# EasyEDA Pro project Smart Coaster_rev1.epro, schematic Smart Coaster

## Sheets
1 HMI: Board Name: Smart Coaster; Create Date: 2025-01-15; Page Name: HMI; Project Name: Smart Coaster; Schematic Name: Smart Coaster; Update Date: 2025-01-17; Company: Paul Hampson; Page Size: A4; Version: V1.0
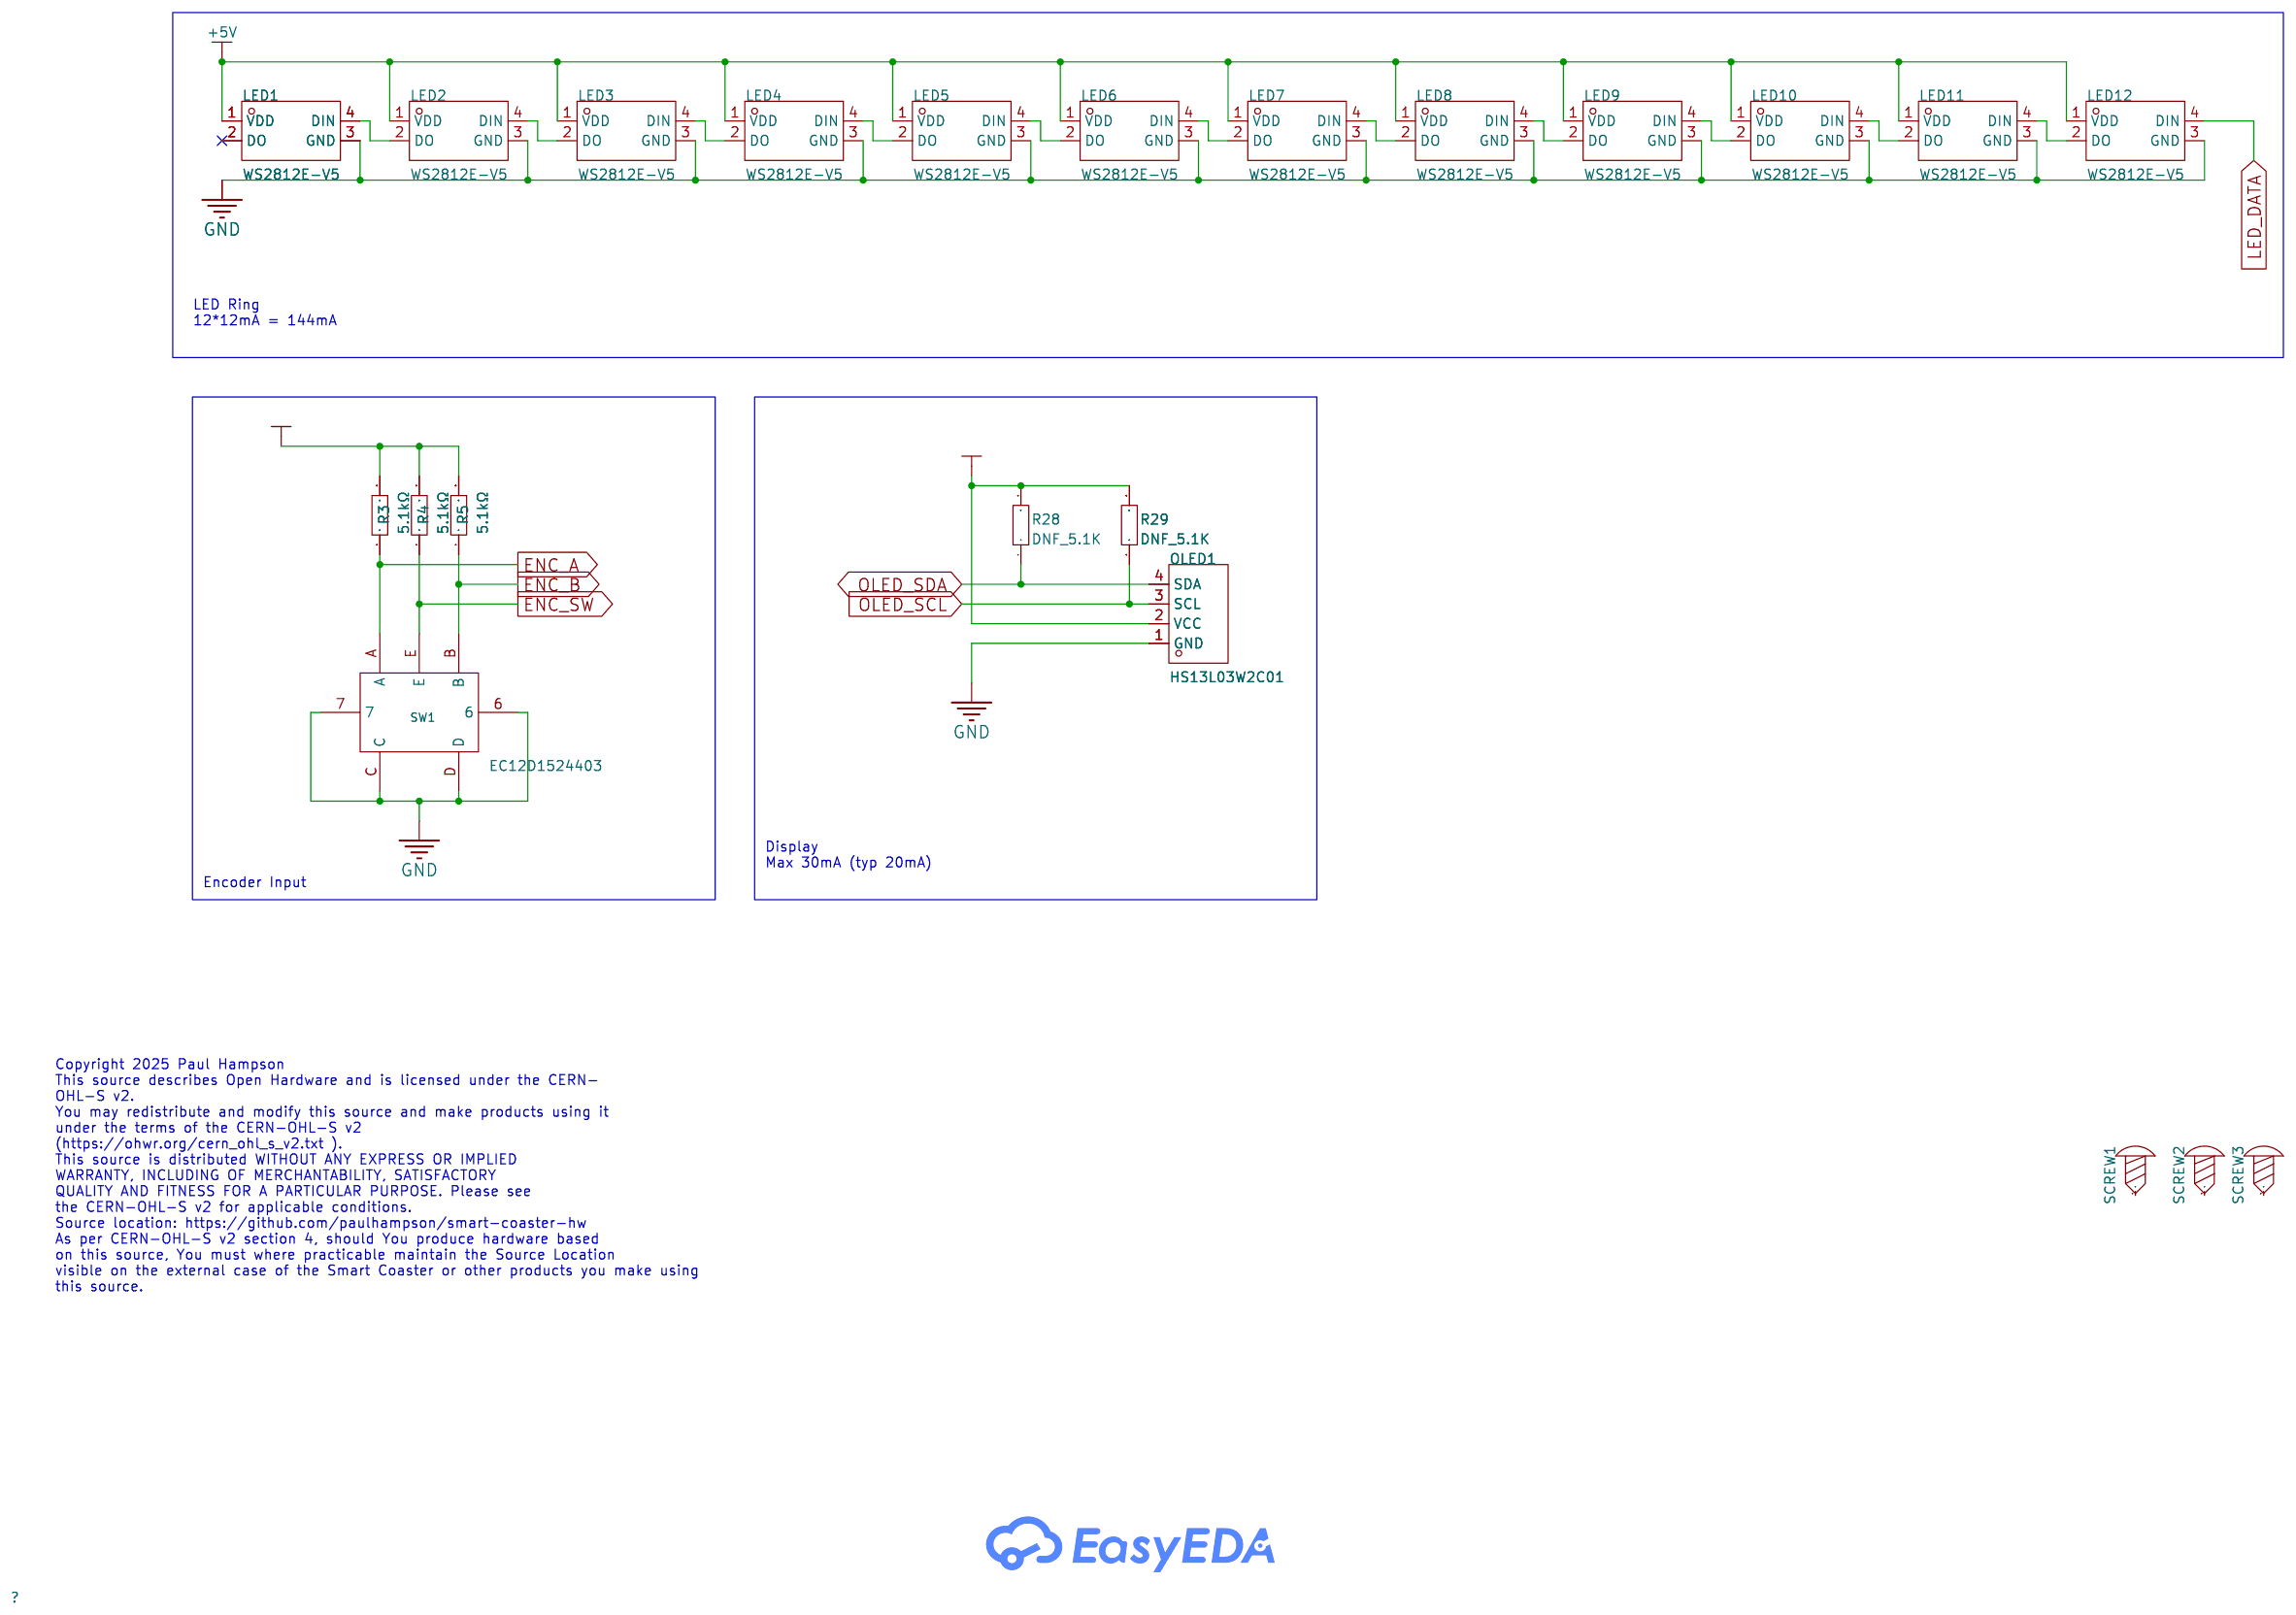
[diagram p0: HMI]
2 Processor: Page Name: Processor
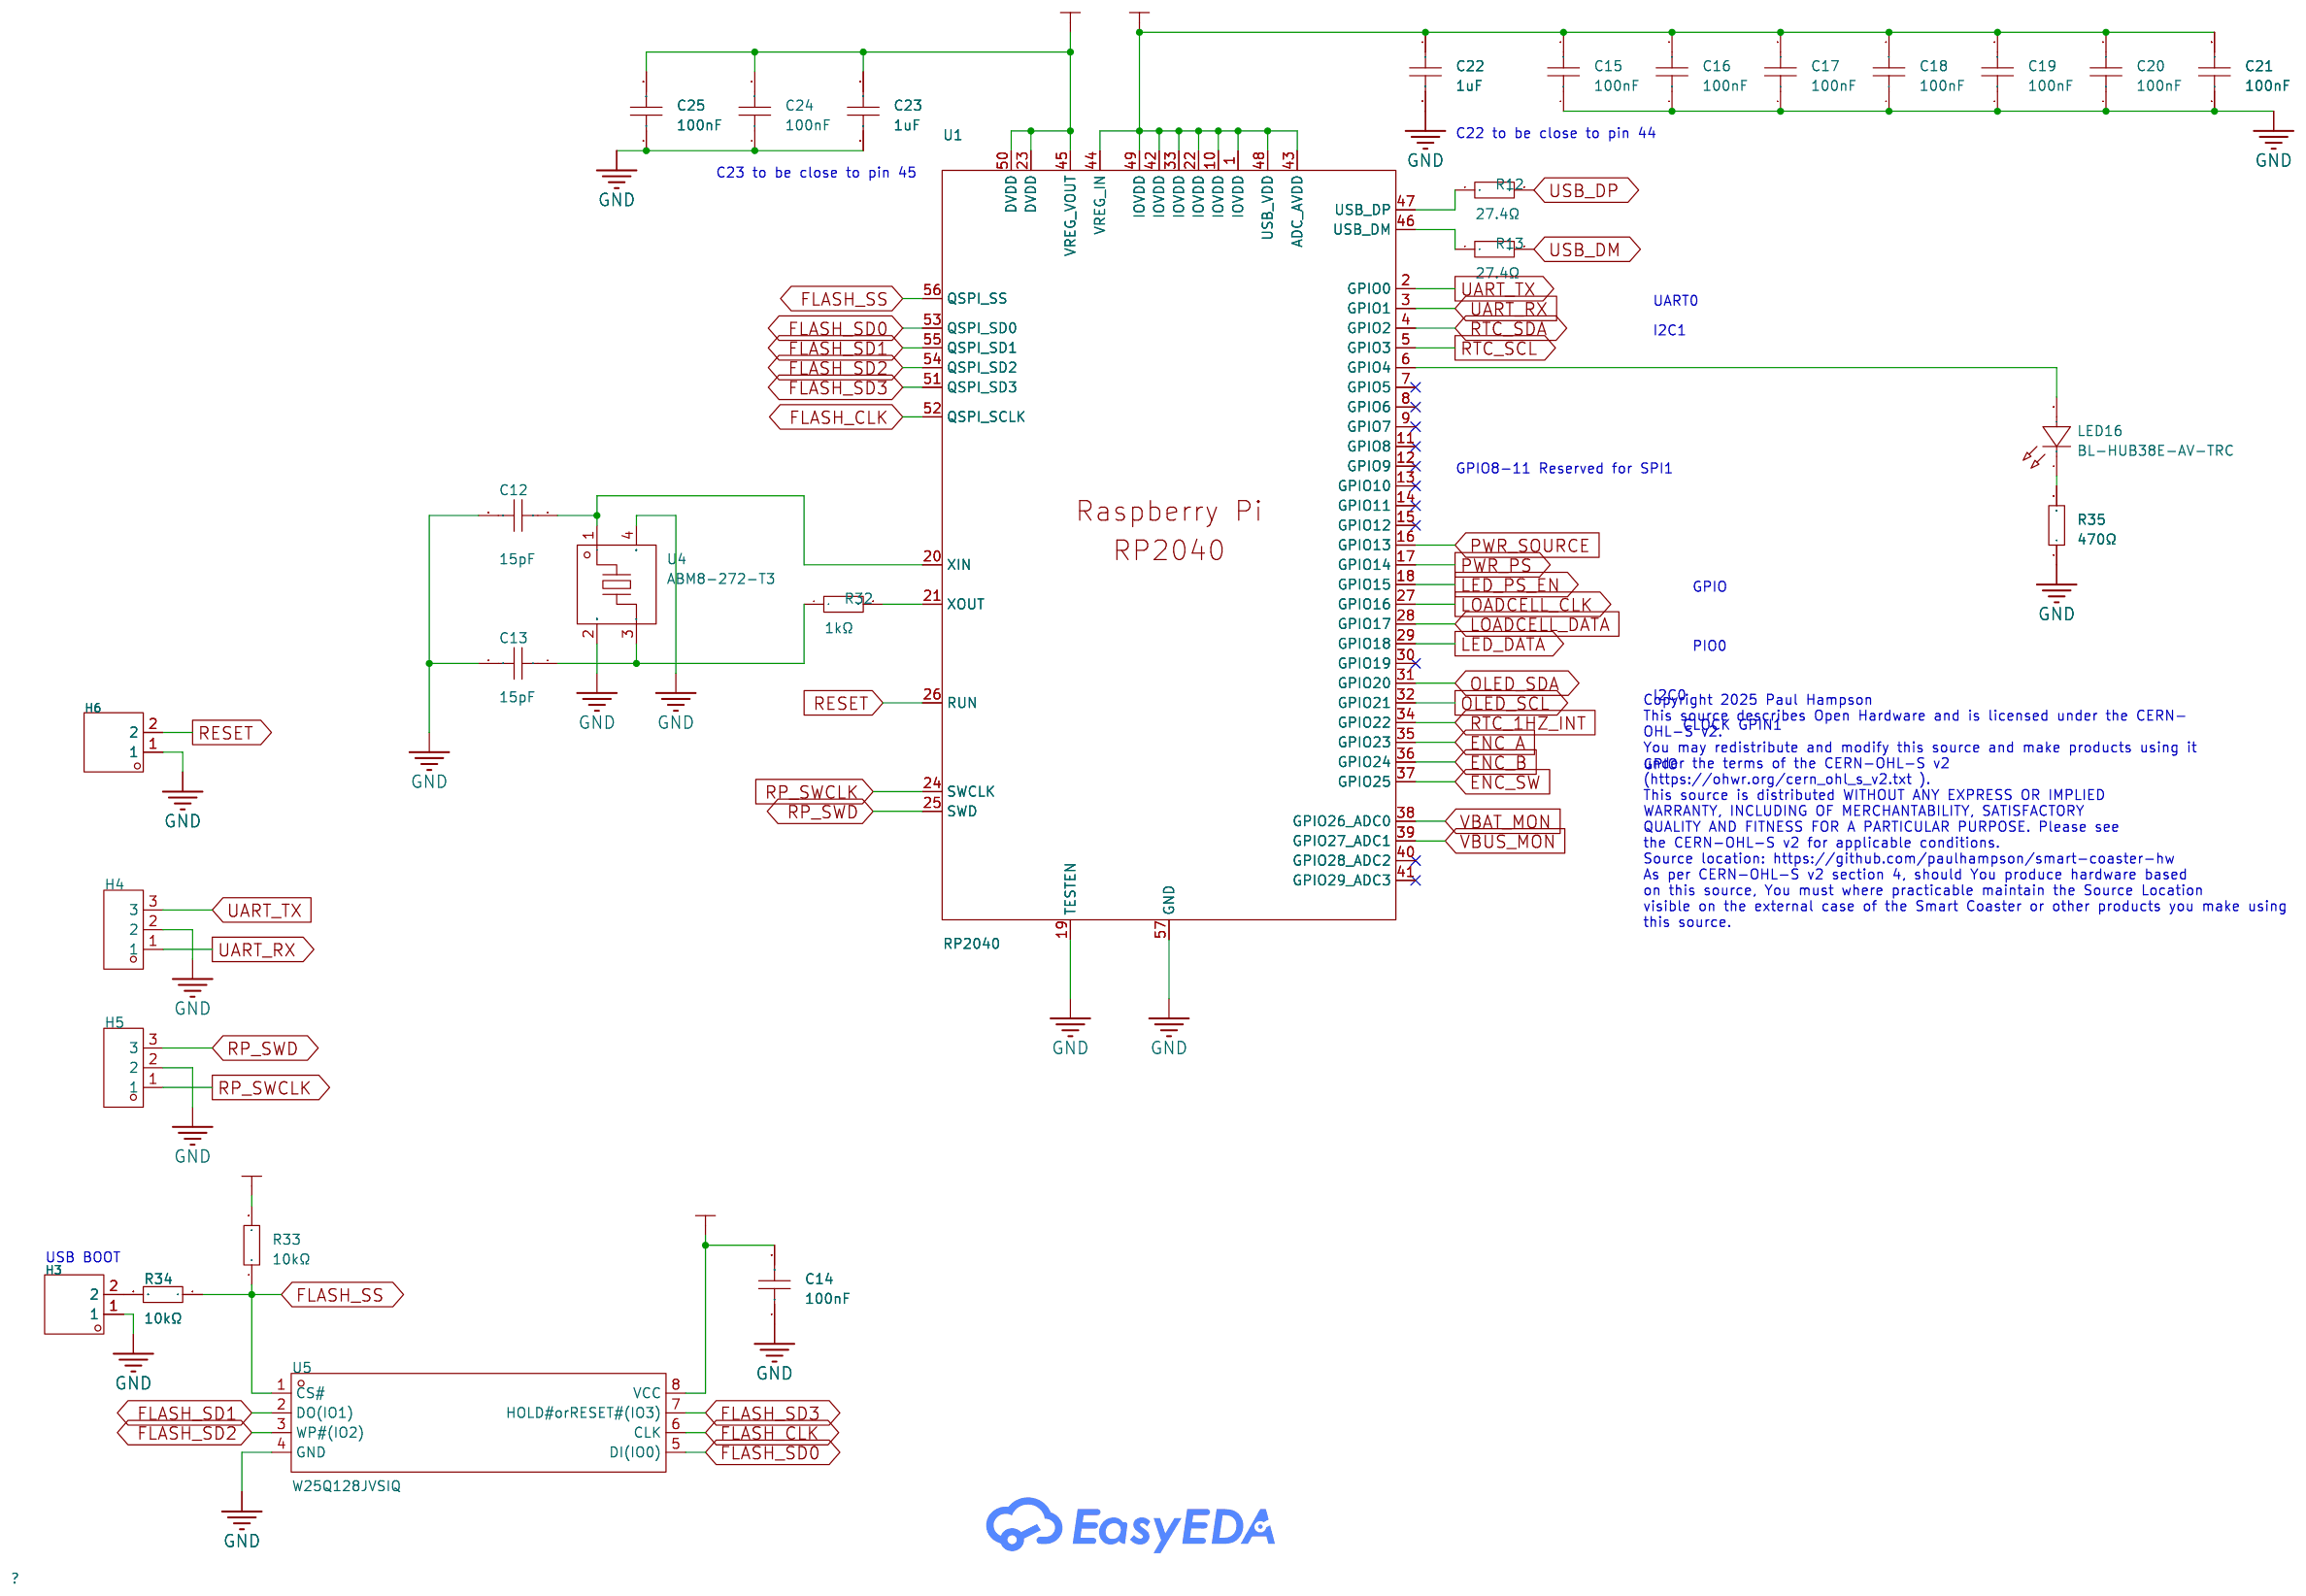
[diagram p1: Processor]
3 Power: Page Name: Power; Update Date: 2025-01-16
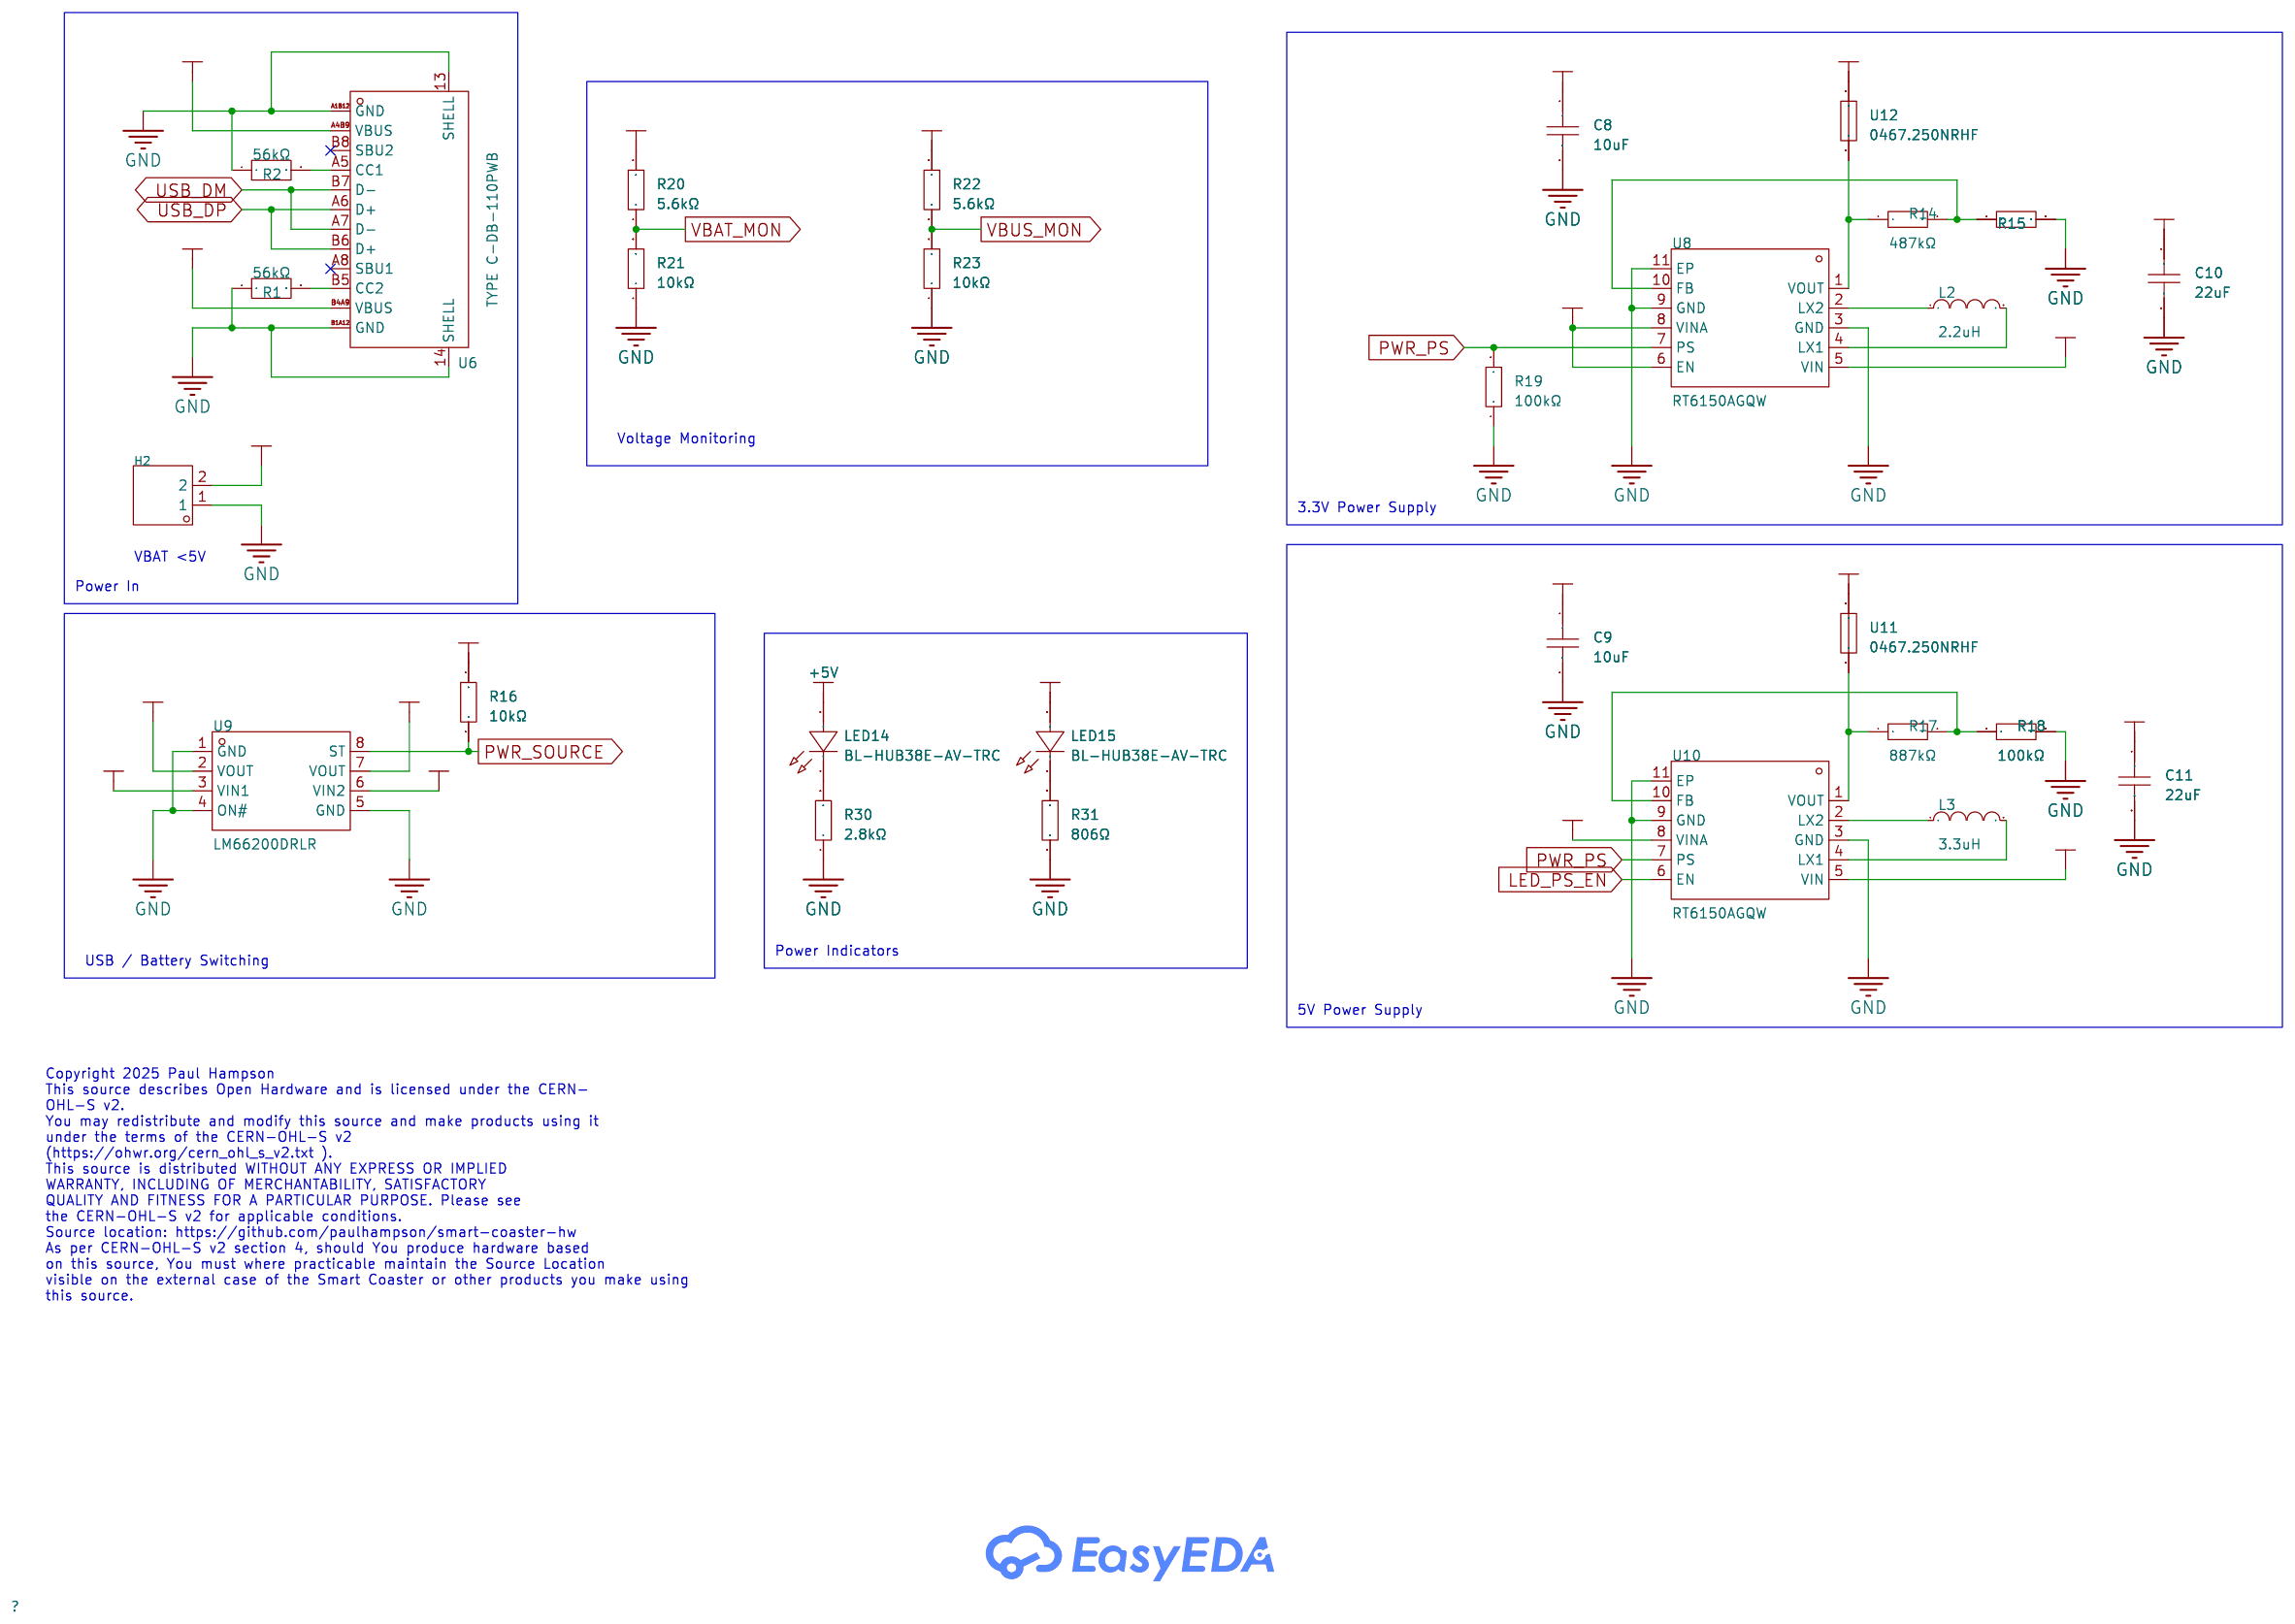
[diagram p2: Power]
4 Load Cell: Page Name: Load Cell; Update Date: 2025-01-16
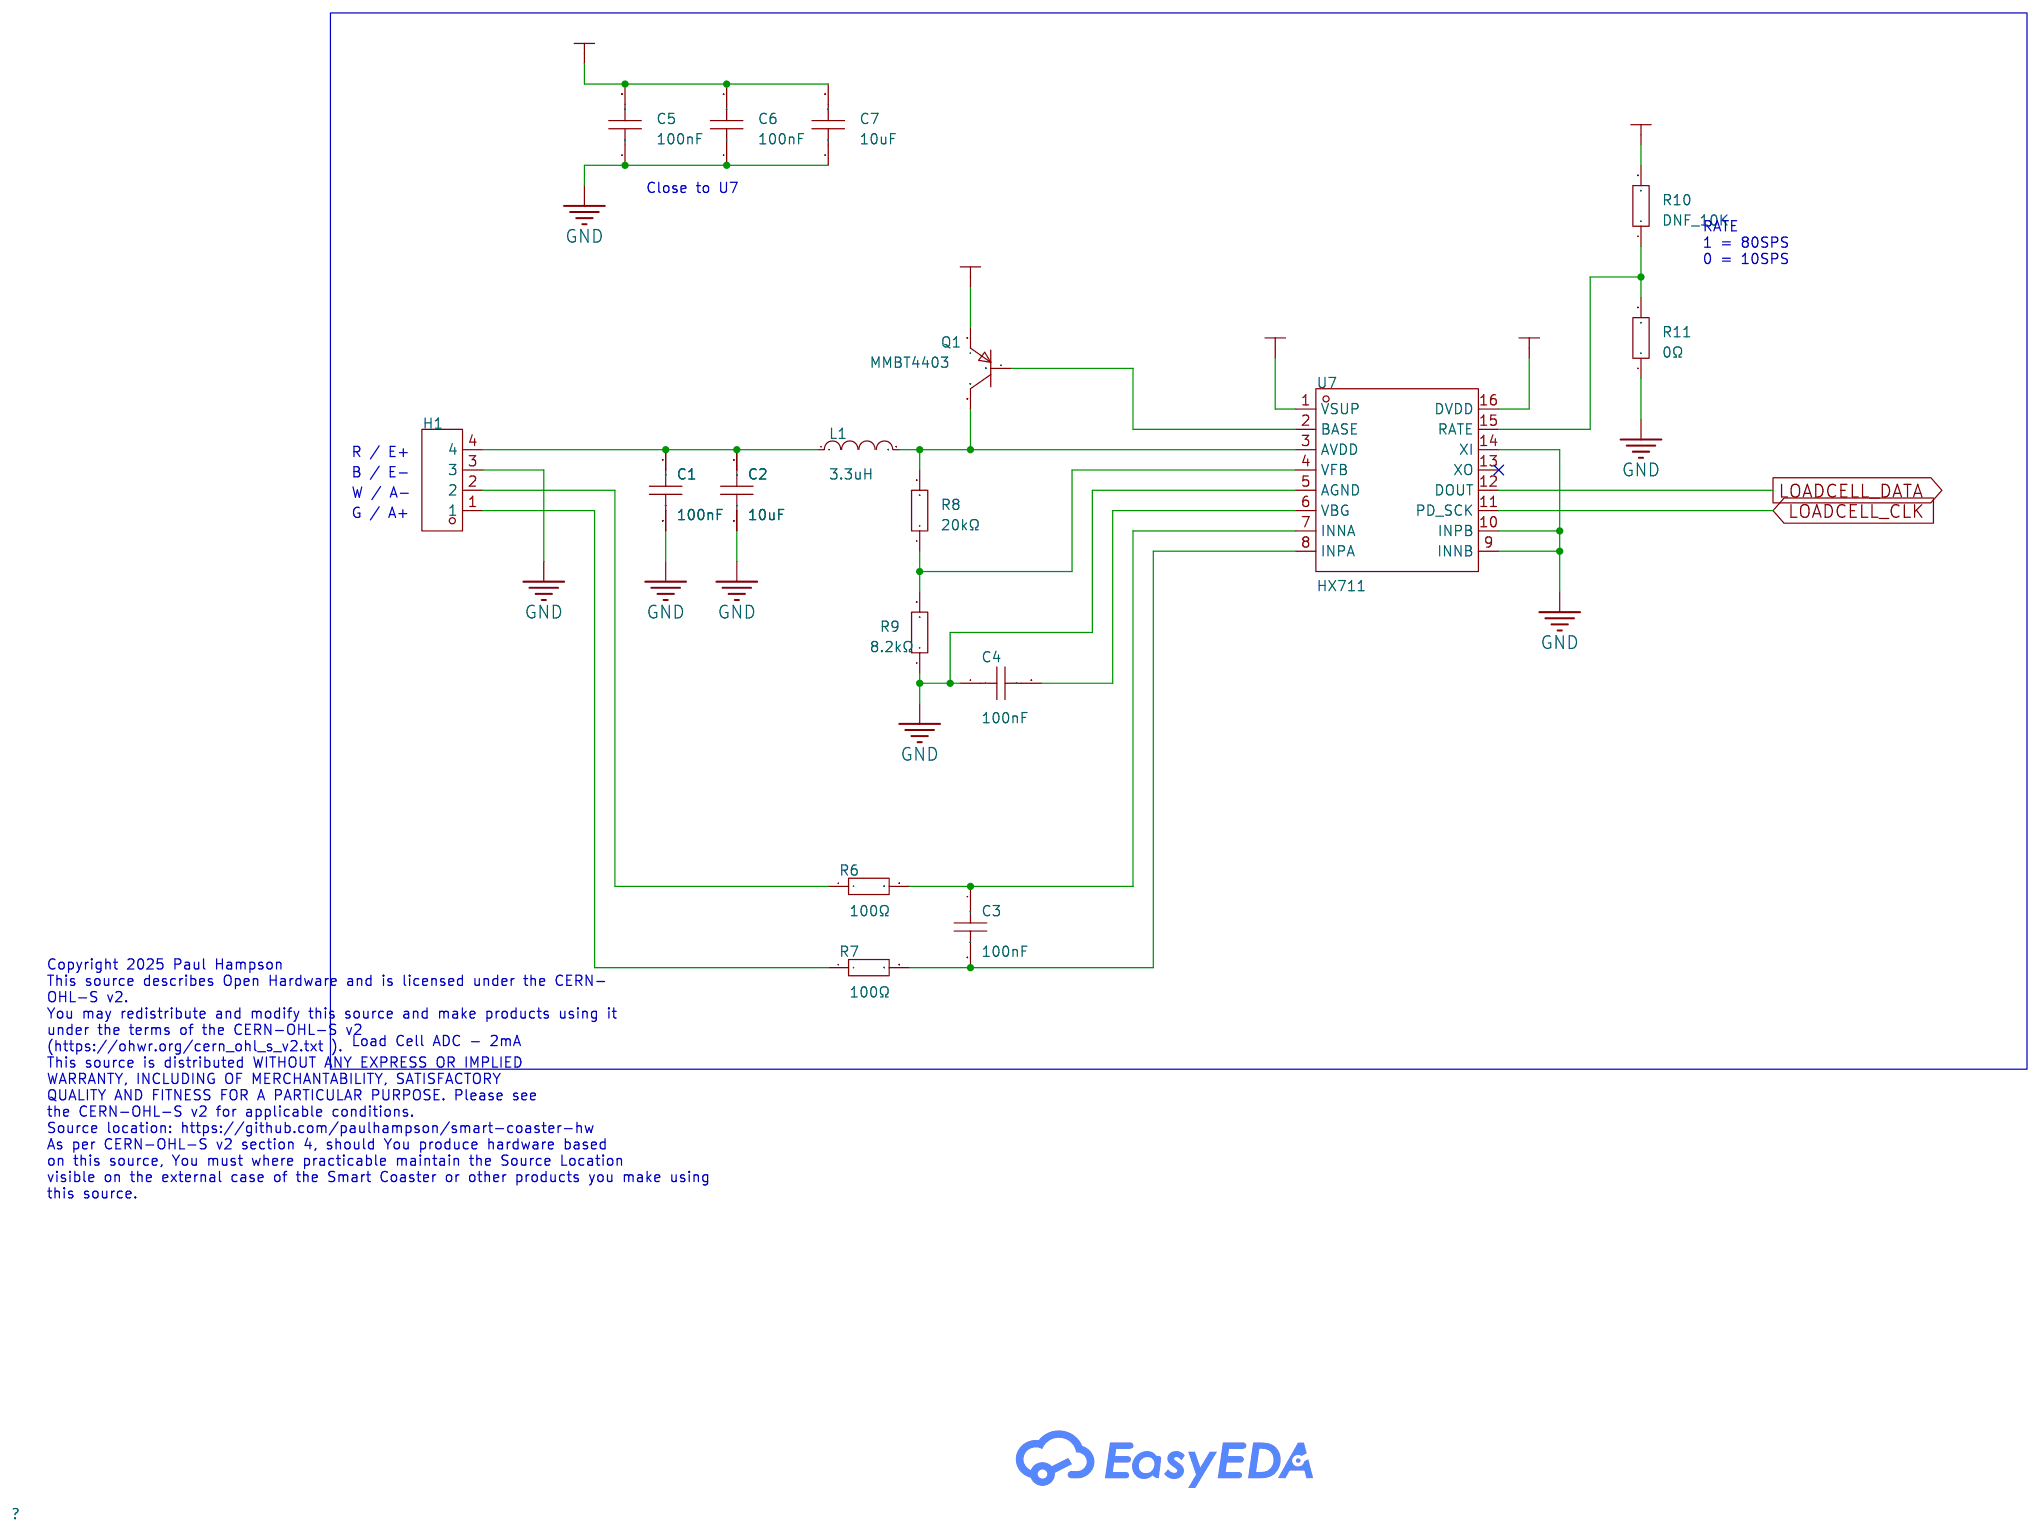
[diagram p3: Load Cell]
5 RTC: Create Date: 2025-01-16; Page Name: RTC
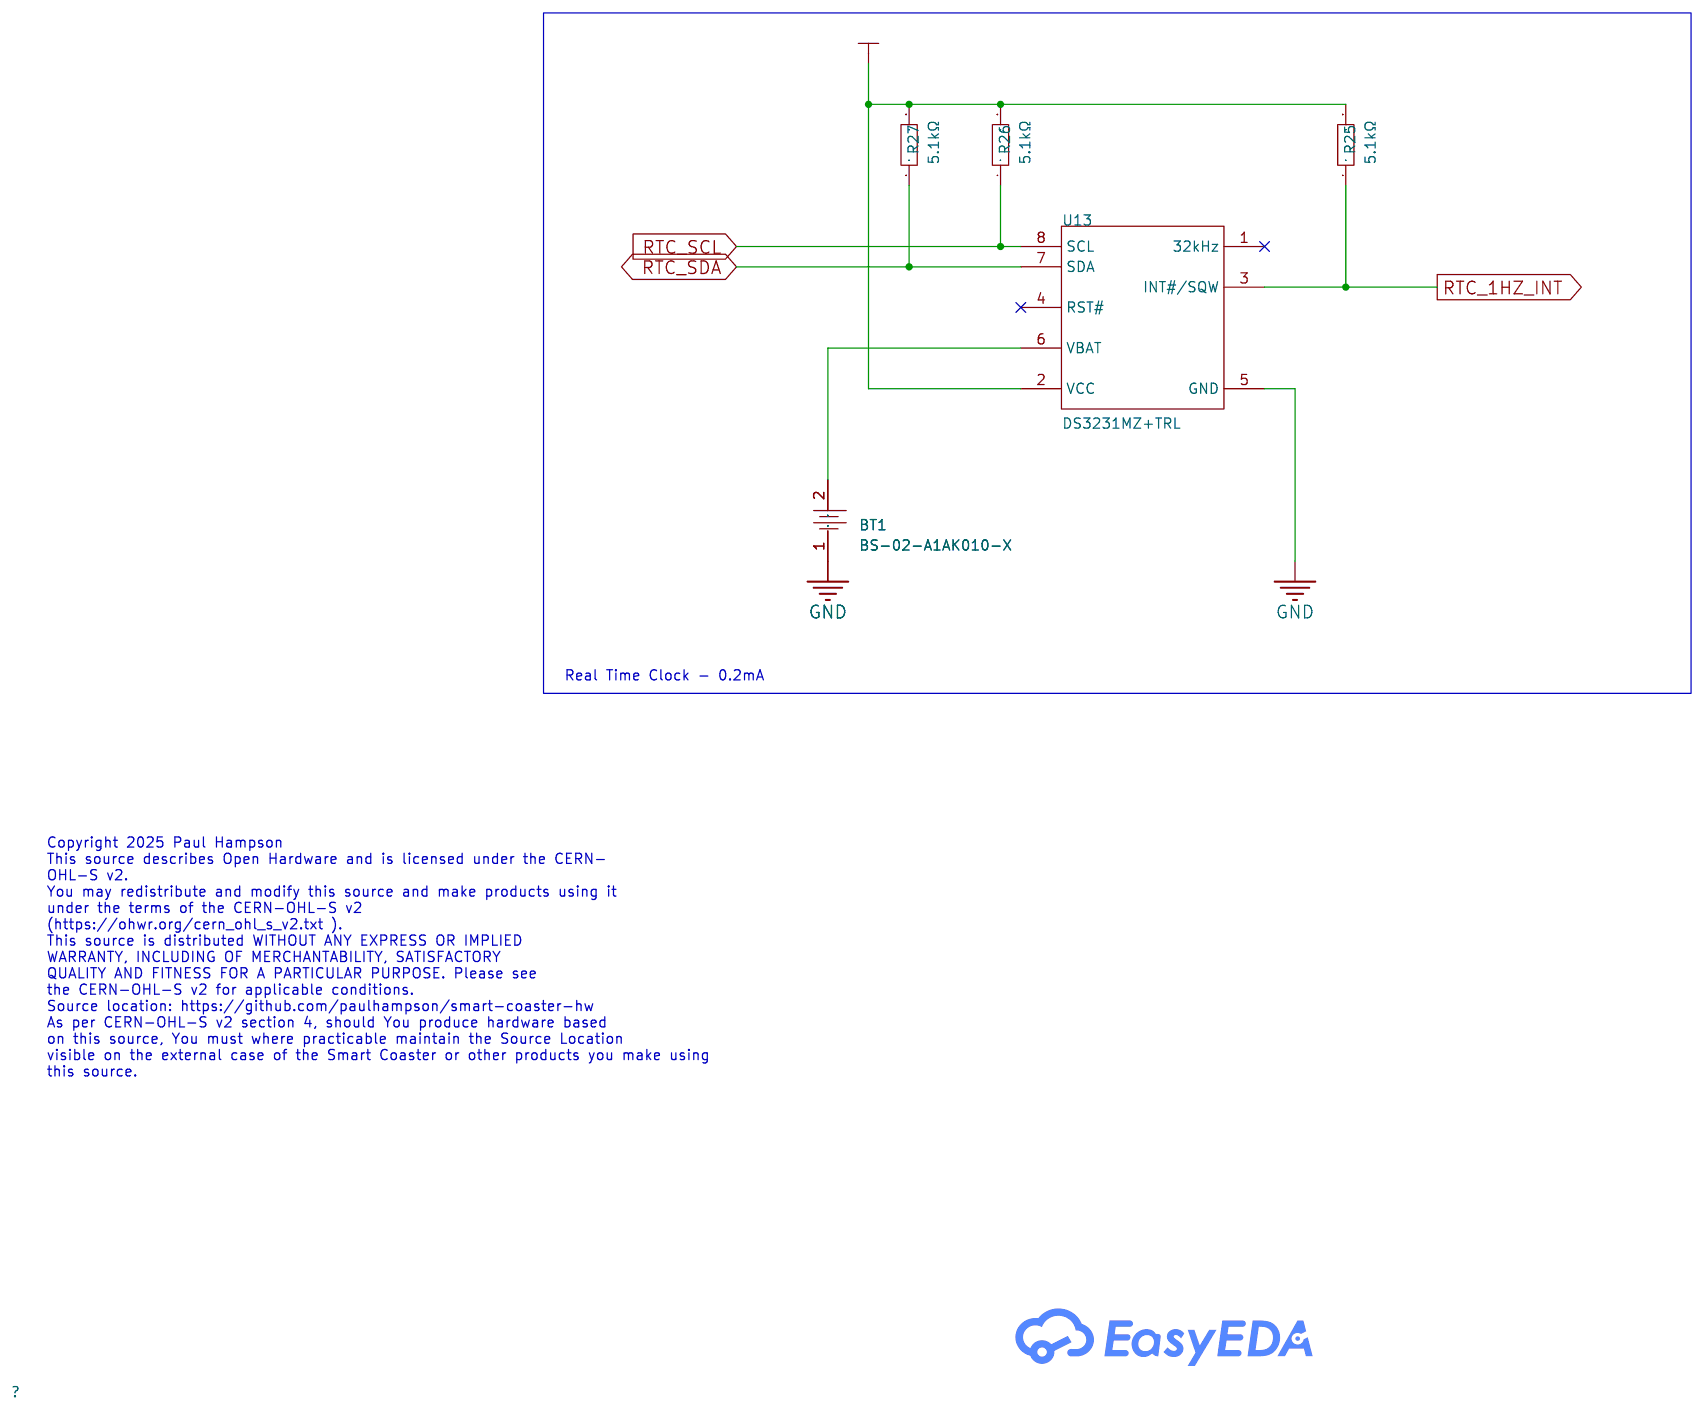
[diagram p4: RTC]

## Parts
sheet HMI
LED1  WS2812E-V5  [LED-SMD_4P-L5.0-W5.0-LS5.4-TL-1]
LED2  WS2812E-V5  [LED-SMD_4P-L5.0-W5.0-LS5.4-TL-1]
LED3  WS2812E-V5  [LED-SMD_4P-L5.0-W5.0-LS5.4-TL-1]
LED4  WS2812E-V5  [LED-SMD_4P-L5.0-W5.0-LS5.4-TL-1]
LED5  WS2812E-V5  [LED-SMD_4P-L5.0-W5.0-LS5.4-TL-1]
LED6  WS2812E-V5  [LED-SMD_4P-L5.0-W5.0-LS5.4-TL-1]
LED7  WS2812E-V5  [LED-SMD_4P-L5.0-W5.0-LS5.4-TL-1]
LED8  WS2812E-V5  [LED-SMD_4P-L5.0-W5.0-LS5.4-TL-1]
LED9  WS2812E-V5  [LED-SMD_4P-L5.0-W5.0-LS5.4-TL-1]
LED10  WS2812E-V5  [LED-SMD_4P-L5.0-W5.0-LS5.4-TL-1]
LED11  WS2812E-V5  [LED-SMD_4P-L5.0-W5.0-LS5.4-TL-1]
LED12  WS2812E-V5  [LED-SMD_4P-L5.0-W5.0-LS5.4-TL-1]
OLED1  HS13L03W2C01  [OLED-TH_L35.4-W33.5_HS13L03W2C01]
R3  5.1kΩ  [R0603]
R4  5.1kΩ  [R0603]
R5  5.1kΩ  [R0603]
R28  DNF_5.1K  [R0603]
R29  DNF_5.1K  [R0603]
SCREW1  -  [Screw-Hole-M3]
SCREW2  -  [Screw-Hole-M3]
SCREW3  -  [Screw-Hole-M3]
SW1  EC12D1524403  [SW-TH_EC12D1524403]
sheet Load Cell
C1  100nF  [C0603]
C2  10uF  [C0603]
C3  100nF  [C0603]
C4  100nF  [C0603]
C5  100nF  [C0603]
C6  100nF  [C0603]
C7  10uF  [C0603]
H1  -  [HDR-TH_4P-P2.54-V-M]
L1  3.3uH  [L0603]
Q1  MMBT4403  [SOT-23-3_L2.9-W1.3-P1.90-LS2.4-BR]
R6  100Ω  [R0603]
R7  100Ω  [R0603]
R8  20kΩ  [R0603]
R9  8.2kΩ  [R0603]
R10  DNF_10K  [R0603]
R11  0Ω  [R0402]
U7  HX711  [SOP-16_L10.0-W3.9-P1.27-LS6.0-BL]
sheet Power
C8  10uF  [C0603]
C9  10uF  [C0603]
C10  22uF  [C0805]
C11  22uF  [C0805]
H2  -  [HDR-TH_2P-P2.54-V-M-1]
L2  2.2uH  [L0805]
L3  3.3uH  [L0805]
LED14  BL-HUB38E-AV-TRC  [LED-SMD_L1.7-W1.1-RD_RED-SIDE]
LED15  BL-HUB38E-AV-TRC  [LED-SMD_L1.7-W1.1-RD_RED-SIDE]
R1  56kΩ  [R0603]
R2  56kΩ  [R0603]
R14  487kΩ  [R0603]
R15  86.6kΩ  [R0603]
R16  10kΩ  [R0603]
R17  887kΩ  [R0603]
R18  100kΩ  [R0603]
R19  100kΩ  [R0603]
R20  5.6kΩ  [R0805]
R21  10kΩ  [R0603]
R22  5.6kΩ  [R0805]
R23  10kΩ  [R0603]
R30  2.8kΩ  [R0402]
R31  806Ω  [R0402]
U6  TYPE C-DB-110PWB  [USB-C-SMD_TYPE-C-DB-111PWB]
U8  RT6150AGQW  [WDFN-10_L3.0-W3.0-P0.50-BL-EP]
U9  LM66200DRLR  [SOT-583-8_L2.1-W1.2-P0.50-LS1.6-BL]
U10  RT6150AGQW  [WDFN-10_L3.0-W3.0-P0.50-BL-EP]
U11  0467.250NRHF  [F0603]
U12  0467.250NRHF  [F0603]
sheet Processor
C12  15pF  [C0402]
C13  15pF  [C0402]
C14  100nF  [C0402]
C15  100nF  [C0402]
C16  100nF  [C0402]
C17  100nF  [C0402]
C18  100nF  [C0402]
C19  100nF  [C0402]
C20  100nF  [C0402]
C21  100nF  [C0402]
C22  1uF  [C0402]
C23  1uF  [C0402]
C24  100nF  [C0402]
C25  100nF  [C0402]
H3  -  [HDR-TH_2P-P2.54-V-M-1]
H4  -  [HDR-TH_3P-P2.54-V-M]
H5  -  [HDR-TH_3P-P2.54-V-M]
H6  -  [HDR-TH_2P-P2.54-V-M-1]
LED16  BL-HUB38E-AV-TRC  [LED-SMD_L1.7-W1.1-RD_RED-SIDE]
R12  27.4Ω  [R0402]
R13  27.4Ω  [R0402]
R32  1kΩ  [R0402]
R33  10kΩ  [R0402]
R34  10kΩ  [R0402]
R35  470Ω  [R0402]
U1  RP2040  [LQFN-56_L7.0-W7.0-P0.4-EP]
U4  ABM8-272-T3  [CRYSTAL-SMD_4P-L3.2-W2.5-BL]
U5  W25Q128JVSIQ  [SOIC-8_L5.3-W5.3-P1.27-LS8.0-BL]
sheet RTC
BT1  BS-02-A1AK010-X  [BAT-TH_BS-02-A1AJ010]
R25  5.1kΩ  [R0603]
R26  5.1kΩ  [R0603]
R27  5.1kΩ  [R0603]
U13  DS3231MZ+TRL  [SOIC-8_L4.9-W3.9-P1.27-LS6.0-BL]

## Library data of the parts
LED1-LED12 = WS2812E-V5: LCSC Part Name: RGB三色; Supplier Part: C2920042; Manufacturer: worldsemi; Supplier Footprint: SMD5050; JLCPCB Part Class: Extended Part; Datasheet: https://atta.szlcsc.com/upload/public/pdf/source/20211117/0464A411C41E6FA3BF6C3A8020ED01CE.pdf; Supplier: LCSC; Check: true
OLED1 = HS13L03W2C01: Main Control Chip:SH1106 Interface Type:I2C Size:1.3 Operating Temperature:-40℃~+70℃ Operating Temperature:-40℃~+70℃; LCSC Part Name: 1.3'1.3寸 128*64 OLED显示屏 I2C通讯 SH1106 白光; Supplier Part: C7465997; Manufacturer: HS(汉昇); JLCPCB Part Class: Extended Part; Datasheet: https://atta.szlcsc.com/upload/public/pdf/source/20230720/8731A47396DED074CDCD72E9ACEFB46F.pdf; Supplier: LCSC; Main Control Chip: SH1106; Interface Type: I2C; Size: 1.3; Operating Temperature: -40℃~+70℃; Check: true
R3-R5 R25-R27 = 0603WAF5101T5E: Type:Thick Film Resistors Resistance:5.1kΩ Tolerance:±1% Tolerance:±1% Power(Watts): Overload Voltage (Max): Temperature Coefficient:±100ppm/℃ Temperature Coefficient:±100ppm/℃ Operating Temperature Range:-55℃~+155℃ Operating Temperature Range:-55℃~+155℃; LCSC Part Name: 5.1kΩ ±1% 100mW 厚膜电阻; Supplier Part: C23186; Manufacturer: UNI-ROYAL(厚声); Supplier Footprint: 0603; JLCPCB Part Class: Basic Part; Datasheet: https://atta.szlcsc.com/upload/public/pdf/source/20200306/C422600_1E6D84923E4A46A82E41ADD87F860B5C.pdf; Supplier: LCSC; Type: Thick Film Resistors; Tolerance: ±1%; Temperature Coefficient: ±100ppm/℃; Operating Temperature Range: -55℃~+155℃
R10 R28 R29 = Res_0603: Supplier Footprint: 0603; Check: false
SCREW1-SCREW3 = Screw-Hole-M3: Supplier Footprint: 插件
SW1 = EC12D1524403: Supplier Part: C112349; Manufacturer: ALPSALPINE(阿尔卑斯阿尔派); Supplier Footprint: 插件; JLCPCB Part Class: Extended Part; Datasheet: https://atta.szlcsc.com/upload/public/pdf/source/20170523/1495533935047.pdf; Supplier: LCSC; Check: true
C1 C3-C6 = CGA0603X7R104K500JT: Capacitance:100nF Tolerance:±10% Tolerance:±10% Voltage Rated:50V Temperature Coefficient:; LCSC Part Name: 100nF ±10% 50V; Supplier Part: C6119867; Manufacturer: HRE(芯声); Supplier Footprint: 0603; JLCPCB Part Class: Extended Part; Supplier: LCSC; Tolerance: ±10%; Voltage Rated: 50V; Check: true
C2 C7-C9 = CL10A106MQ8NNNC: Capacitance: Tolerance:±20% Tolerance:±20% Voltage Rated: Temperature Coefficient:; LCSC Part Name: 10uF ±20% 6.3V; Supplier Part: C1691; Manufacturer: SAMSUNG(三星); Supplier Footprint: 0603; JLCPCB Part Class: Extended Part; Datasheet: https://atta.szlcsc.com/upload/public/pdf/source/20160218/1457707763339.pdf; Supplier: LCSC; Tolerance: ±20%
H1 = HDR-M_2.54_1x4P: Supplier Footprint: Through; Check: false
L1 = SCL1608Q3R3KSP: Inductance: Tolerance:±10% Tolerance:±10% Rated Current: Saturation Current (Isat):- DC Resistance (DCR): Q @ Freq:- Frequency - Self Resonant:- Ratings:; LCSC Part Name: 3.3uH ±10%; Supplier Part: C411948; Manufacturer: Sunltech(韩国顺磁); Supplier Footprint: 0603; JLCPCB Part Class: Extended Part; Datasheet: https://atta.szlcsc.com/upload/public/pdf/source/20200731/C411944_7C8237E998DB3EB3F4322F140BC617BA.pdf; Supplier: LCSC; Tolerance: ±10%
Q1 = MMBT4403_C699234: Transistor Type: Collector Current (Ic):600mA Collector-Emitter Breakdown Voltage (Vceo): Power Dissipation (Pd):300mW DC Current Gain (hFE@Ic,Vce):100@150mA,2V DC Current Gain (hFE@Ic,Vce):100@150mA,2V Transition Frequency (fT):200MHz Collector Cut-Off C; Supplier Part: C699234; Manufacturer: YANGJIE(扬杰); Supplier Footprint: SOT-23(TO-236); JLCPCB Part Class: Extended Part; Datasheet: https://atta.szlcsc.com/upload/public/pdf/source/20200709/C699234_CEBC5487FB916D5CBDF220B2A01038BE.pdf; Supplier: LCSC; Collector Current (Ic): 600mA; Power Dissipation (Pd): 300mW; DC Current Gain (hFE@Ic,Vce): 100@150mA,2V; Transition Frequency (fT): 200MHz; Collector Cut-Off Current (Icbo): 100nA; Collector-Emitter Saturation Voltage (VCE(sat)@Ic,Ib): 400mV@150mA,15mA; Operating Temperature: -55℃~+150℃; Check: true
R6 R7 = RTT03101JTP: Type:Thick Film Resistors Resistance: Tolerance:±5% Tolerance:±5% Power(Watts): Overload Voltage (Max): Temperature Coefficient:±100ppm/℃ Temperature Coefficient:±100ppm/℃ Operating Temperature Range:-55℃~+155℃ Operating Temperature Range:-55℃~+155℃; LCSC Part Name: 厚膜电阻 100Ω ±5% 100mW; Supplier Part: C103204; Manufacturer: RALEC(旺诠); Supplier Footprint: 0603; JLCPCB Part Class: Extended Part; Datasheet: https://atta.szlcsc.com/upload/public/pdf/source/20191219/C158410_884373A5B7E1BC76BF57BC45A946C093.pdf; Supplier: LCSC; Type: Thick Film Resistors; Tolerance: ±5%; Temperature Coefficient: ±100ppm/℃; Operating Temperature Range: -55℃~+155℃
R8 = 0603WAJ0203T5E: Type:Thick Film Resistors Resistance:20kΩ Tolerance:±5% Tolerance:±5% Power(Watts): Overload Voltage (Max): Temperature Coefficient:±100ppm/℃ Temperature Coefficient:±100ppm/℃ Operating Temperature Range:-55℃~+155℃ Operating Temperature Range:-55℃~+155℃; LCSC Part Name: 20kΩ ±5% 100mW 厚膜电阻; Supplier Part: C25586; Manufacturer: UNI-ROYAL(厚声); Supplier Footprint: 0603; JLCPCB Part Class: Extended Part; Datasheet: https://atta.szlcsc.com/upload/public/pdf/source/20200306/C422600_1E6D84923E4A46A82E41ADD87F860B5C.pdf; Supplier: LCSC; Type: Thick Film Resistors; Tolerance: ±5%; Temperature Coefficient: ±100ppm/℃; Operating Temperature Range: -55℃~+155℃
R9 = 0603WAJ0822T5E: Type:Thick Film Resistors Resistance:8.2kΩ Tolerance:±5% Tolerance:±5% Power(Watts): Overload Voltage (Max): Temperature Coefficient:±100ppm/℃ Temperature Coefficient:±100ppm/℃ Operating Temperature Range:-55℃~+155℃ Operating Temperature Range:-55℃~+155℃; LCSC Part Name: 8.2kΩ ±5% 100mW 厚膜电阻; Supplier Part: C26007; Manufacturer: UNI-ROYAL(厚声); Supplier Footprint: 0603; JLCPCB Part Class: Extended Part; Datasheet: https://atta.szlcsc.com/upload/public/pdf/source/20200306/C422600_1E6D84923E4A46A82E41ADD87F860B5C.pdf; Supplier: LCSC; Type: Thick Film Resistors; Tolerance: ±5%; Temperature Coefficient: ±100ppm/℃; Operating Temperature Range: -55℃~+155℃
R11 = SCR0402J0R: Type:Thick Film Resistors Resistance:0Ω Tolerance:±5% Tolerance:±5% Power(Watts): Overload Voltage (Max): Operating Temperature Range:-55℃~+155℃ Operating Temperature Range:-55℃~+155℃; LCSC Part Name: 厚膜电阻 0Ω ±5% 62.5mW; Supplier Part: C3017451; Manufacturer: VO(翔胜); Supplier Footprint: 0402; JLCPCB Part Class: Extended Part; Datasheet: https://atta.szlcsc.com/upload/public/pdf/source/20220513/247AF9639BA21CF93567DC289CCC6A22.pdf; Supplier: LCSC; Type: Thick Film Resistors; Tolerance: ±5%; Operating Temperature Range: -55℃~+155℃
U7 = HX711_C6705483: resolution:24Bit number of channels:2 Supply Voltage:2.7V~5.5V Supply Voltage:2.7V~5.5V differential input:Yes Integral nonlinearity:- Integral nonlinearity:- Operating Temperature:-40℃~+85℃ Operating Temperature:-40℃~+85℃; Supplier Part: C6705483; Manufacturer: AVIA(海芯科技); Supplier Footprint: SOP-16; JLCPCB Part Class: Extended Part; Datasheet: https://atta.szlcsc.com/upload/public/pdf/source/20240910/523FF17855B2F1313F971C77291F913D.pdf; Supplier: LCSC; resolution: 24Bit; number of channels: 2; Supply Voltage: 2.7V~5.5V; differential input: Yes; Operating Temperature: -40℃~+85℃; Check: true
C10 C11 = CL21A226MAYNNNE: Capacitance: Tolerance:±20% Tolerance:±20% Voltage Rated: Temperature Coefficient:; LCSC Part Name: 22uF ±20% 25V; Supplier Part: C602037; Manufacturer: SAMSUNG(三星); Supplier Footprint: 0805; JLCPCB Part Class: Extended Part; Datasheet: https://atta.szlcsc.com/upload/public/pdf/source/20200609/C602037_1A0D619693E608A1BF6E80154254E2DB.pdf; Supplier: LCSC; Tolerance: ±20%
H2 = HDR-M_2.54_1x2P: Supplier Footprint: Through; Check: true
L2 = AHW2012F-2R2KTF: Inductance: Tolerance:±10% Tolerance:±10% Rated Current: DC Resistance (DCR):1.5Ω Q @ Freq:12 Frequency - Self Resonant:170MHz Type:Wire-wound Chip Inductor; LCSC Part Name: 2.2uH ±10%; Supplier Part: C6364725; Manufacturer: APV(爱普微); Supplier Footprint: 0805; JLCPCB Part Class: Extended Part; Datasheet: https://atta.szlcsc.com/upload/public/pdf/source/20230523/E53ED9368637CE3FE1F67F3D75587EF6.pdf; Supplier: LCSC; Tolerance: ±10%; DC Resistance (DCR): 1.5Ω; Q @ Freq: 12; Frequency - Self Resonant: 170MHz; Type: Wire-wound Chip Inductor
L3 = AHW2012F-3R3KTF: Inductance: Tolerance:±10% Tolerance:±10% Rated Current: DC Resistance (DCR):1.8Ω Q @ Freq:12 Frequency - Self Resonant: Type:Wire-wound Chip Inductor; LCSC Part Name: 3.3uH ±10%; Supplier Part: C7427080; Manufacturer: APV(爱普微); Supplier Footprint: 0805; JLCPCB Part Class: Extended Part; Datasheet: https://atta.szlcsc.com/upload/public/pdf/source/20230614/2E76576E1BBB05D78279947F77F32D1C.pdf; Supplier: LCSC; Tolerance: ±10%; DC Resistance (DCR): 1.8Ω; Q @ Freq: 12; Type: Wire-wound Chip Inductor
LED14-LED16 = BL-HUB38E-AV-TRC: Emitted Color:Red Forward Current:-; LCSC Part Name: 0603侧发光红光; Supplier Part: C7421380; Manufacturer: BrtLed(佰鸿); Supplier Footprint: SMD,1.7x0.6mm; JLCPCB Part Class: Extended Part; Datasheet: https://atta.szlcsc.com/upload/public/pdf/source/20240328/31ADF7D73B25A82C334FEDBD9A9D06F5.pdf; Supplier: LCSC; Emitted Color: Red
R1 R2 = SCR0603J56K: Type:Thick Film Resistors Resistance: Tolerance:±5% Tolerance:±5% Power(Watts): Overload Voltage (Max): Operating Temperature Range:-55℃~+155℃ Operating Temperature Range:-55℃~+155℃; LCSC Part Name: 厚膜电阻 56kΩ ±5% 100mW; Supplier Part: C3017697; Manufacturer: VO(翔胜); Supplier Footprint: 0603; JLCPCB Part Class: Extended Part; Datasheet: https://atta.szlcsc.com/upload/public/pdf/source/20220513/247AF9639BA21CF93567DC289CCC6A22.pdf; Supplier: LCSC; Type: Thick Film Resistors; Tolerance: ±5%; Operating Temperature Range: -55℃~+155℃; Check: true
R14 = 0603WAF4873T5E: Type:Thick Film Resistors Resistance:487kΩ Tolerance:±1% Tolerance:±1% Power(Watts): Overload Voltage (Max): Temperature Coefficient:±100ppm/℃ Temperature Coefficient:±100ppm/℃ Operating Temperature Range:-55℃~+155℃ Operating Temperature Range:-55℃~+155℃; LCSC Part Name: 487kΩ ±1% 100mW 厚膜电阻; Supplier Part: C23183; Manufacturer: UNI-ROYAL(厚声); Supplier Footprint: 0603; JLCPCB Part Class: Extended Part; Datasheet: https://atta.szlcsc.com/upload/public/pdf/source/20200306/C422600_1E6D84923E4A46A82E41ADD87F860B5C.pdf; Supplier: LCSC; Type: Thick Film Resistors; Tolerance: ±1%; Temperature Coefficient: ±100ppm/℃; Operating Temperature Range: -55℃~+155℃
R15 = 0603WAF8662T5E: Type:Thick Film Resistors Resistance:86.6kΩ Tolerance:±1% Tolerance:±1% Power(Watts): Overload Voltage (Max): Temperature Coefficient:±100ppm/℃ Temperature Coefficient:±100ppm/℃ Operating Temperature Range:-55℃~+155℃ Operating Temperature Range:-55℃~+155℃; LCSC Part Name: 86.6kΩ ±1% 100mW 厚膜电阻; Supplier Part: C23121; Manufacturer: UNI-ROYAL(厚声); Supplier Footprint: 0603; JLCPCB Part Class: Extended Part; Datasheet: https://atta.szlcsc.com/upload/public/pdf/source/20200306/C422600_1E6D84923E4A46A82E41ADD87F860B5C.pdf; Supplier: LCSC; Type: Thick Film Resistors; Tolerance: ±1%; Temperature Coefficient: ±100ppm/℃; Operating Temperature Range: -55℃~+155℃
R16 R21 R23 = 0603WAF1002T5E: Type:Thick Film Resistors Resistance:10kΩ Tolerance:±1% Tolerance:±1% Power(Watts): Overload Voltage (Max): Temperature Coefficient:±100ppm/℃ Temperature Coefficient:±100ppm/℃ Operating Temperature Range:-55℃~+155℃ Operating Temperature Range:-55℃~+155℃; LCSC Part Name: 厚膜电阻 10kΩ ±1% 100mW; Supplier Part: C25804; Manufacturer: UNI-ROYAL(厚声); Supplier Footprint: 0603; JLCPCB Part Class: Basic Part; Datasheet: https://atta.szlcsc.com/upload/public/pdf/source/20200306/C422600_1E6D84923E4A46A82E41ADD87F860B5C.pdf; Supplier: LCSC; Type: Thick Film Resistors; Tolerance: ±1%; Temperature Coefficient: ±100ppm/℃; Operating Temperature Range: -55℃~+155℃
R17 = ERJ3EKF8873V: Type:Thick Film Resistors Resistance:887kΩ Tolerance:±1% Tolerance:±1% Power(Watts): Overload Voltage (Max): Temperature Coefficient:±100ppm/℃ Temperature Coefficient:±100ppm/℃ Operating Temperature Range:-55℃~+155℃ Operating Temperature Range:-55℃~+155℃; LCSC Part Name: 887kΩ ±1% 100mW 厚膜电阻; Supplier Part: C403386; Manufacturer: PANASONIC(松下); Supplier Footprint: 0603; JLCPCB Part Class: Extended Part; Datasheet: https://atta.szlcsc.com/upload/public/pdf/source/20190709/C403410_4AA7B6683950D876CE9308C181828FCD.pdf; Supplier: LCSC; Type: Thick Film Resistors; Tolerance: ±1%; Temperature Coefficient: ±100ppm/℃; Operating Temperature Range: -55℃~+155℃
R18 R19 = 0603WAF1003T5E: Type:Thick Film Resistors Resistance:100kΩ Tolerance:±1% Tolerance:±1% Power(Watts): Overload Voltage (Max): Temperature Coefficient:±100ppm/℃ Temperature Coefficient:±100ppm/℃ Operating Temperature Range:-55℃~+155℃ Operating Temperature Range:-55℃~+155℃; LCSC Part Name: 100kΩ ±1% 100mW 厚膜电阻; Supplier Part: C25803; Manufacturer: UNI-ROYAL(厚声); Supplier Footprint: 0603; JLCPCB Part Class: Basic Part; Datasheet: https://atta.szlcsc.com/upload/public/pdf/source/20200306/C422600_1E6D84923E4A46A82E41ADD87F860B5C.pdf; Supplier: LCSC; Type: Thick Film Resistors; Tolerance: ±1%; Temperature Coefficient: ±100ppm/℃; Operating Temperature Range: -55℃~+155℃
R20 R22 = 0805W8F5601T5E: Type:Thick Film Resistors Resistance:5.6kΩ Tolerance:±1% Tolerance:±1% Power(Watts): Overload Voltage (Max): Temperature Coefficient:±100ppm/℃ Temperature Coefficient:±100ppm/℃ Operating Temperature Range:-55℃~+155℃ Operating Temperature Range:-55℃~+155℃; LCSC Part Name: 5.6kΩ ±1% 125mW 厚膜电阻; Supplier Part: C4382; Manufacturer: UNI-ROYAL(厚声); Supplier Footprint: 0805; JLCPCB Part Class: Basic Part; Datasheet: https://atta.szlcsc.com/upload/public/pdf/source/20200306/C422600_1E6D84923E4A46A82E41ADD87F860B5C.pdf; Supplier: LCSC; Type: Thick Film Resistors; Tolerance: ±1%; Temperature Coefficient: ±100ppm/℃; Operating Temperature Range: -55℃~+155℃
R30 = 0402WGF2801TCE: Type:Thick Film Resistors Resistance:2.8kΩ Tolerance:±1% Tolerance:±1% Power(Watts): Overload Voltage (Max): Temperature Coefficient:±100ppm/℃ Temperature Coefficient:±100ppm/℃ Operating Temperature Range:-55℃~+155℃ Operating Temperature Range:-55℃~+155℃; LCSC Part Name: 2.8kΩ ±1% 62.5mW 厚膜电阻; Supplier Part: C62741; Manufacturer: UNI-ROYAL(厚声); Supplier Footprint: 0402; JLCPCB Part Class: Extended Part; Datasheet: https://atta.szlcsc.com/upload/public/pdf/source/20200306/C422600_1E6D84923E4A46A82E41ADD87F860B5C.pdf; Supplier: LCSC; Type: Thick Film Resistors; Tolerance: ±1%; Temperature Coefficient: ±100ppm/℃; Operating Temperature Range: -55℃~+155℃
R31 = 0402WGF8060TCE: Type:Thick Film Resistors Resistance: Tolerance:±1% Tolerance:±1% Power(Watts): Overload Voltage (Max): Temperature Coefficient:±100ppm/℃ Temperature Coefficient:±100ppm/℃ Operating Temperature Range:-55℃~+155℃ Operating Temperature Range:-55℃~+155℃; LCSC Part Name: 806Ω ±1% 62.5mW 厚膜电阻; Supplier Part: C407662; Manufacturer: UNI-ROYAL(厚声); Supplier Footprint: 0402; JLCPCB Part Class: Extended Part; Datasheet: https://atta.szlcsc.com/upload/public/pdf/source/20200306/C422600_1E6D84923E4A46A82E41ADD87F860B5C.pdf; Supplier: LCSC; Type: Thick Film Resistors; Tolerance: ±1%; Temperature Coefficient: ±100ppm/℃; Operating Temperature Range: -55℃~+155℃
U6 = TYPE C-DB-110PWB: Connector Type:Type-C Standard:USB 3.1 Gender:- Mounting Style:Sinking plate Number of Contacts:16P Number of Ports:- Current Rating - Power (Max):- Contact Material:- Contact Plating:- Operating Temperature Range:- Operating Temperature Range:-; LCSC Part Name: Type-C 沉板; Supplier Part: C2936186; Manufacturer: HDGC(华德共创); Supplier Footprint: SMD; JLCPCB Part Class: Extended Part; Datasheet: https://atta.szlcsc.com/upload/public/pdf/source/20211227/355E430B74EE1B57F984662FD73C8486.pdf; Supplier: LCSC; Connector Type: Type-C; Standard: USB 3.1; Mounting Style: Sinking plate; Number of Contacts: 16P; Check: true
U8 U10 = RT6150AGQW: Function:Boost type Input Voltage:1.8V~5.5V Input Voltage:1.8V~5.5V Output Voltage:1.8V~5.5V Output Voltage:1.8V~5.5V Output Current:800mA Switching Frequency:1MHz Switching Frequency:1MHz Operating Temperature:-40℃~+125℃@(TJ) Operating Temperature:-40℃~+; Supplier Part: C147971; Manufacturer: RICHTEK(立锜); Supplier Footprint: WDFN-10-EP(3x3); JLCPCB Part Class: Extended Part; Datasheet: https://atta.szlcsc.com/upload/public/pdf/source/20180126/C147972_15169561259341309260.pdf; Supplier: LCSC; Function: Boost type; Input Voltage: 1.8V~5.5V; Output Voltage: 1.8V~5.5V; Output Current: 800mA; Switching Frequency: 1MHz; Operating Temperature: -40℃~+125℃@(TJ); Synchronous Rectification: Yes; Number of Outputs: 1; Topology: Step-down-Boost; Switch tube (built-in/external): Built-in; Check: true
U9 = LM66200DRLR: Output Current:2.5A Input Voltage:1.6V~5.5V Input Voltage:1.6V~5.5V Operating Temperature	-:-40℃~+125℃ Operating Temperature	-:-40℃~+125℃; Supplier Part: C3235556; Manufacturer: TI(德州仪器); Supplier Footprint: SOT-583; JLCPCB Part Class: Extended Part; Datasheet: https://www.ti.com/cn/lit/gpn/lm66200; Supplier: LCSC; Output Current: 2.5A; Input Voltage: 1.6V~5.5V; Operating Temperature	-: -40℃~+125℃; Check: true
U11 U12 = 0467.250NRHF: Type:SMD Fuse Current Rating:250mA Voltage Rating  (AC):32V Voltage Rating (DC):32V Operating Temperature:-55℃~+90℃ Operating Temperature:-55℃~+90℃ Breaking Capacity:50A; LCSC Part Name: 32V贴片式保险丝; Supplier Part: C151137; Manufacturer: Littelfuse(美国力特); Supplier Footprint: 0603; JLCPCB Part Class: Extended Part; Datasheet: https://atta.szlcsc.com/upload/public/pdf/source/20171201/C151140_15121178500441156397.pdf; Supplier: LCSC; Type: SMD Fuse; Current Rating: 250mA; Voltage Rating  (AC): 32V; Voltage Rating (DC): 32V; Operating Temperature: -55℃~+90℃; Breaking Capacity: 50A; Check: true
C12 C13 = CC0402JRNPO9BN150: Capacitance: Tolerance:±5% Tolerance:±5% Voltage Rated: Temperature Coefficient:; LCSC Part Name: 15pF ±5% 50V; Supplier Part: C106997; Manufacturer: YAGEO(国巨); Supplier Footprint: 0402; JLCPCB Part Class: Extended Part; Datasheet: https://atta.szlcsc.com/upload/public/pdf/source/20170914/C128857_1505359892143968080.pdf; Supplier: LCSC; Tolerance: ±5%
C14-C21 C24 C25 = CL05B104KO5NNNC: Capacitance: Tolerance:±10% Tolerance:±10% Voltage Rated: Temperature Coefficient:; LCSC Part Name: 100nF ±10% 16V; Supplier Part: C1525; Manufacturer: SAMSUNG(三星); Supplier Footprint: 0402; JLCPCB Part Class: Basic Part; Datasheet: https://atta.szlcsc.com/upload/public/pdf/source/20160218/1457707763339.pdf; Supplier: LCSC; Tolerance: ±10%
C22 C23 = CL05A105KP5NNNC: Capacitance: Tolerance:±10% Tolerance:±10% Voltage Rated: Temperature Coefficient:; LCSC Part Name: 1uF ±10% 10V; Supplier Part: C14445; Manufacturer: SAMSUNG(三星); Supplier Footprint: 0402; JLCPCB Part Class: Extended Part; Datasheet: https://atta.szlcsc.com/upload/public/pdf/source/20160218/1457707763339.pdf; Supplier: LCSC; Tolerance: ±10%
H3 H6 = HDR-M_2.54_1x2P: Supplier Footprint: Through
H4 H5 = HDR-M_2.54_1x3P: Supplier Footprint: Through; Check: false
R12 R13 = 0402WGF274JTCE: Type:Thick Film Resistors Resistance:27.4Ω Tolerance:±1% Tolerance:±1% Power(Watts): Overload Voltage (Max): Temperature Coefficient:±100ppm/℃ Temperature Coefficient:±100ppm/℃ Operating Temperature Range:-55℃~+155℃ Operating Temperature Range:-55℃~+155℃; LCSC Part Name: 27.4Ω ±1% 62.5mW 厚膜电阻; Supplier Part: C31439; Manufacturer: UNI-ROYAL(厚声); Supplier Footprint: 0402; JLCPCB Part Class: Extended Part; Datasheet: https://atta.szlcsc.com/upload/public/pdf/source/20200306/C422600_1E6D84923E4A46A82E41ADD87F860B5C.pdf; Supplier: LCSC; Type: Thick Film Resistors; Tolerance: ±1%; Temperature Coefficient: ±100ppm/℃; Operating Temperature Range: -55℃~+155℃
R32 = 0402WGF1001TCE: Type:Thick Film Resistors Resistance:1kΩ Tolerance:±1% Tolerance:±1% Power(Watts): Overload Voltage (Max): Temperature Coefficient:±100ppm/℃ Temperature Coefficient:±100ppm/℃ Operating Temperature Range:-55℃~+155℃ Operating Temperature Range:-55℃~+155℃; LCSC Part Name: 1kΩ ±1% 62.5mW 厚膜电阻; Supplier Part: C11702; Manufacturer: UNI-ROYAL(厚声); Supplier Footprint: 0402; JLCPCB Part Class: Basic Part; Datasheet: https://atta.szlcsc.com/upload/public/pdf/source/20200306/C422600_1E6D84923E4A46A82E41ADD87F860B5C.pdf; Supplier: LCSC; Type: Thick Film Resistors; Tolerance: ±1%; Temperature Coefficient: ±100ppm/℃; Operating Temperature Range: -55℃~+155℃
R33 R34 = 0402WGJ0103TCE: Type:Thick Film Resistors Resistance:10kΩ Tolerance:±5% Tolerance:±5% Power(Watts): Overload Voltage (Max): Temperature Coefficient:±100ppm/℃ Temperature Coefficient:±100ppm/℃ Operating Temperature Range:-55℃~+155℃ Operating Temperature Range:-55℃~+155℃; LCSC Part Name: 10kΩ ±5% 62.5mW 厚膜电阻; Supplier Part: C25531; Manufacturer: UNI-ROYAL(厚声); Supplier Footprint: 0402; JLCPCB Part Class: Extended Part; Datasheet: https://atta.szlcsc.com/upload/public/pdf/source/20200306/C422600_1E6D84923E4A46A82E41ADD87F860B5C.pdf; Supplier: LCSC; Type: Thick Film Resistors; Tolerance: ±5%; Temperature Coefficient: ±100ppm/℃; Operating Temperature Range: -55℃~+155℃
R35 = 0402WGF4700TCE: Type:Thick Film Resistors Resistance: Tolerance:±1% Tolerance:±1% Power(Watts): Overload Voltage (Max): Temperature Coefficient:±100ppm/℃ Temperature Coefficient:±100ppm/℃ Operating Temperature Range:-55℃~+155℃ Operating Temperature Range:-55℃~+155℃; LCSC Part Name: 470Ω ±1% 62.5mW 厚膜电阻; Supplier Part: C25117; Manufacturer: UNI-ROYAL(厚声); Supplier Footprint: 0402; JLCPCB Part Class: Basic Part; Datasheet: https://atta.szlcsc.com/upload/public/pdf/source/20200306/C422600_1E6D84923E4A46A82E41ADD87F860B5C.pdf; Supplier: LCSC; Type: Thick Film Resistors; Tolerance: ±1%; Temperature Coefficient: ±100ppm/℃; Operating Temperature Range: -55℃~+155℃
U1 = RP2040_C2040: CPU Core:- RAM Size:264KB GPIO Ports Number:30 Operating Voltage Range:- Operating Voltage Range:- CPU Maximum Speed:133MHz Program Memory Type:- Operating Temperature Range:- Operating Temperature Range:- ADC (Bit):12bit DAC (Bit):- PWM (Bit):- 8Bit Time; LCSC Part Name: RP2040（RP2B2）; Supplier Part: C2040; Manufacturer: Raspberry Pi(树莓派); Supplier Footprint: LQFN-56(7x7); JLCPCB Part Class: Extended Part; Datasheet: https://atta.szlcsc.com/upload/public/pdf/source/20210621/C2040_96F425825606B7957D87DD32E2512CA9.pdf; Supplier: LCSC; RAM Size: 264KB; GPIO Ports Number: 30; CPU Maximum Speed: 133MHz; ADC (Bit): 12bit; UART/USART: 2; I2C: 2; SPI: 2; Universal Serial Bus: 有; Peripheral/Function: DMA；PWM; Direct Memory Access: 有; Check: true
U4 = ABM8-272-T3_C20625731: Supplier Part: C20625731; Manufacturer: ABRACON; Supplier Footprint: SMD3225-4P; JLCPCB Part Class: Extended Part; Datasheet: https://atta.szlcsc.com/upload/public/pdf/source/20240227/A8BE43F636D80F75C9AF5C59EDF21E9A.pdf; Supplier: LCSC; Check: true
U5 = W25Q128JVSIQ_C113767: Interface Type:SPI Memory Size:128Mbit Supply Voltage:2.7V~3.6V Supply Voltage:2.7V~3.6V Page Programming Time (Tpp):3ms Operating Temperature:-40℃~+85℃ Operating Temperature:-40℃~+85℃; Supplier Part: C113767; Manufacturer: WINBOND(华邦); Supplier Footprint: SOIC-8-208mil; JLCPCB Part Class: Extended Part; Datasheet: https://atta.szlcsc.com/upload/public/pdf/source/20180329/C113767_097B64D788F6E3FFB2E9CB46CB6C1427.pdf; Supplier: LCSC; Interface Type: SPI; Memory Size: 128Mbit; Supply Voltage: 2.7V~3.6V; Page Programming Time (Tpp): 3ms; Operating Temperature: -40℃~+85℃; Check: true
BT1 = BS-02-A1AK010-X: Connector Type:Battery holder Battery Type:CR2032 Contact Material:Phosphor Bronze Contact Plating:Tin Operating Temperature Range:-25℃~+85℃ Operating Temperature Range:-25℃~+85℃; LCSC Part Name: 电池底座 适用电池:CR2032; Supplier Part: C19184089; Manufacturer: MYOUNG(美阳); Supplier Footprint: 插件; JLCPCB Part Class: Extended Part; Datasheet: https://atta.szlcsc.com/upload/public/pdf/source/20231108/B20F90E204019921C64A54B32600B0E3.pdf; Supplier: LCSC; Connector Type: Battery holder; Battery Type: CR2032; Contact Material: Phosphor Bronze; Contact Plating: Tin; Operating Temperature Range: -25℃~+85℃
U13 = DS3231MZ+TRL: Interface:I2C Operating Voltage:2.3V~5.5V Operating Voltage:2.3V~5.5V Operating Temperature:-40℃~+85℃ Operating Temperature:-40℃~+85℃; LCSC Part Name: 高精度RTC集成MEMS谐振器; Supplier Part: C107410; Manufacturer: ADI(亚德诺)/MAXIM(美信); Supplier Footprint: SOIC-8; JLCPCB Part Class: Extended Part; Datasheet: https://atta.szlcsc.com/upload/public/pdf/source/20170620/1497944726830.pdf; Supplier: LCSC; Interface: I2C; Operating Voltage: 2.3V~5.5V; Operating Temperature: -40℃~+85℃

## Nets
1V1: C23.1 C24.2 C25.2 U1.23(DVDD) U1.45(VREG_VOUT) U1.50(DVDD)
3V3: C5.2 C6.2 C7.2 C10.1 C14.2 C15.2 C16.2 C17.2 C18.2 C19.2 C20.2 C21.2 C22.1 LED15.2(A) OLED1.2(VCC) Q1.2(E) R3.2 R4.2 R5.2 R10.2 R25.2 R26.2 R27.2 R28.2 R29.2 R33.2 U1.1(IOVDD) U1.10(IOVDD) U1.22(IOVDD) U1.33(IOVDD) U1.42(IOVDD) U1.43(ADC_AVDD) U1.44(VREG_IN) U1.48(USB_VDD) U1.49(IOVDD) U5.8(VCC) U7.1(VSUP) U7.16(DVDD) U12.2 U13.2(VCC)
+5V: C11.1 LED1.1(VDD) LED2.1(VDD) LED3.1(VDD) LED4.1(VDD) LED5.1(VDD) LED6.1(VDD) LED7.1(VDD) LED8.1(VDD) LED9.1(VDD) LED10.1(VDD) LED11.1(VDD) LED12.1(VDD) LED14.2(A) U11.2
GND: BT1.1 C1.2 C2.2 C4.1 C5.1 C6.1 C7.1 C8.2 C9.2 C10.2 C11.2 C12.2 C13.2 C14.1 C15.1 C16.1 C17.1 C18.1 C19.1 C20.1 C21.1 C22.2 C23.2 C24.1 C25.1 H1.3 H2.1 H3.1 H4.2 H5.2 H6.1 LED1.3(GND) LED2.3(GND) LED3.3(GND) LED4.3(GND) LED5.3(GND) LED6.3(GND) LED7.3(GND) LED8.3(GND) LED9.3(GND) LED10.3(GND) LED11.3(GND) LED12.3(GND) OLED1.1(GND) R1.1 R2.1 R9.1 R11.1 R15.2 R18.2 R19.1 R21.1 R23.1 R30.1 R31.1 R35.1 SW1.6 SW1.7 SW1.C SW1.D U1.19(TESTEN) U1.57(GND) U4.2(GND) U4.4(GND) U5.4(GND) U6.13(SHELL) U6.14(SHELL) U6.A1B12(GND) U6.B1A12(GND) U7.5(AGND) U7.9(INNB) U7.10(INPB) U7.14(XI) U8.3(GND) U8.9(GND) U8.11(EP) U9.1(GND) U9.4(ON#) U9.5(GND) U10.3(GND) U10.9(GND) U10.11(EP) U13.5(GND)
VBAT: H2.2 R20.2 U9.6(VIN2)
VBAT_MON: R20.1 R21.2 U1.38(GPIO26_ADC0)
VBUS: R16.2 R22.2 U6.A4B9(VBUS) U6.B4A9(VBUS) U9.3(VIN1)
VBUS_MON: R22.1 R23.2 U1.39(GPIO27_ADC1)
ENC_A: R3.1 SW1.A U1.35(GPIO23)
ENC_B: R5.1 SW1.B U1.36(GPIO24)
ENC_SW: R4.1 SW1.E U1.37(GPIO25)
FLASH_CLK: U1.52(QSPI_SCLK) U5.6(CLK)
FLASH_SD0: U1.53(QSPI_SD0) U5.5(DI(IO0))
FLASH_SD1: U1.55(QSPI_SD1) U5.2(DO(IO1))
FLASH_SD2: U1.54(QSPI_SD2) U5.3(WP#(IO2))
FLASH_SD3: U1.51(QSPI_SD3) U5.7(HOLD#orRESET#(IO3))
FLASH_SS: R33.1 R34.1 U1.56(QSPI_SS) U5.1(CS#)
LED_DATA: LED12.4(DIN) U1.29(GPIO18)
LED_PS_EN: U1.18(GPIO15) U10.6(EN)
LOADCELL_CLK: U1.27(GPIO16) U7.11(PD_SCK)
LOADCELL_DATA: U1.28(GPIO17) U7.12(DOUT)
OLED_SCL: OLED1.3(SCL) R29.1 U1.32(GPIO21)
OLED_SDA: OLED1.4(SDA) R28.1 U1.31(GPIO20)
PWR_PS: R19.2 U1.17(GPIO14) U8.7(PS) U10.7(PS)
PWR_SOURCE: R16.1 U1.16(GPIO13) U9.8(ST)
RESET: H6.2 U1.26(RUN)
RP_SWCLK: H5.1 U1.24(SWCLK)
RP_SWD: H5.3 U1.25(SWD)
RTC_1HZ_INT: R25.1 U1.34(GPIO22) U13.3(INT#/SQW)
RTC_SCL: R26.1 U1.5(GPIO3) U13.8(SCL)
RTC_SDA: R27.1 U1.4(GPIO2) U13.7(SDA)
UART_RX: H4.1 U1.3(GPIO1)
UART_TX: H4.3 U1.2(GPIO0)
USB_DM: R13.2 U6.A7(D-) U6.B7(D-)
USB_DP: R12.2 U6.A6(D+) U6.B6(D+)
VSRC: C8.1 C9.1 U8.5(VIN) U8.6(EN) U8.8(VINA) U9.2(VOUT) U9.7(VOUT) U10.5(VIN) U10.8(VINA)
$1N2063: LED1.4(DIN) LED2.2(DO)
$1N2139: LED3.4(DIN) LED4.2(DO)
$1N2145: LED2.4(DIN) LED3.2(DO)
$1N2293: LED5.4(DIN) LED6.2(DO)
$1N2297: LED7.4(DIN) LED8.2(DO)
$1N2301: LED6.4(DIN) LED7.2(DO)
$1N2449: LED9.4(DIN) LED10.2(DO)
$1N2453: LED11.4(DIN) LED12.2(DO)
$1N2457: LED10.4(DIN) LED11.2(DO)
$1N2463: LED4.4(DIN) LED5.2(DO)
$1N2469: LED8.4(DIN) LED9.2(DO)
$2N848: R12.1 U1.47(USB_DP)
$2N853: R13.1 U1.46(USB_DM)
$2N1332: R32.2 U1.21(XOUT)
$2N1336: C13.1 R32.1 U4.3
$2N1341: C12.1 U1.20(XIN) U4.1
$2N1749: H3.2 R34.2
$2N4132: LED16.1(K) R35.2
$2N4619: LED16.2(A) U1.6(GPIO4)
$3N482: R1.2 U6.B5(CC2)
$3N500: R2.2 U6.A5(CC1)
$3N1315: R14.2 R15.1 U8.10(FB)
$3N1562: R14.1 U8.1(VOUT) U12.1
$3N1650: L2.1 U8.2(LX2)
$3N1654: L2.2 U8.4(LX1)
$3N2042: R17.2 R18.1 U10.10(FB)
$3N2068: R17.1 U10.1(VOUT) U11.1
$3N2075: L3.1 U10.2(LX2)
$3N2077: L3.2 U10.4(LX1)
$3N3460: LED14.1(K) R30.2
$3N3570: LED15.1(K) R31.2
$4N387: C1.1 C2.1 H1.4 L1.1
$4N408: L1.2 Q1.3(C) R8.2 U7.3(AVDD)
$4N509: C3.2 R7.2 U7.8(INPA)
$4N513: C3.1 R6.2 U7.7(INNA)
$4N518: H1.2 R6.1
$4N525: H1.1 R7.1
$4N604: R8.1 R9.2 U7.4(VFB)
$4N666: C4.2 U7.6(VBG)
$4N934: R10.1 R11.2 U7.15(RATE)
$4N1097: Q1.1(B) U7.2(BASE)
$5N278: BT1.2 U13.6(VBAT)

Not connected (* = marked no-connect by the designer): LED1 2(DO)*; SCREW1 1; SCREW2 1; SCREW3 1; U1 7(GPIO5)* 8(GPIO6)* 9(GPIO7)* 11(GPIO8)* 12(GPIO9)* 13(GPIO10)* 14(GPIO11)* 15(GPIO12)* 30(GPIO19)* 40(GPIO28_ADC2)* 41(GPIO29_ADC3)*; U6 A8(SBU1)* B8(SBU2)*; U7 13(XO)*; U13 1(32kHz)* 4(RST#)*

## Notes on the sheets
sheet 1
- LED Ring
  12*12mA = 144mA
- Display
  Max 30mA (typ 20mA)
- Encoder Input
- Copyright 2025 Paul Hampson
  This source describes Open Hardware and is licensed under the CERN-
  OHL-S v2.
  You may redistribute and modify this source and make products using it
  under the terms of the CERN-OHL-S v2
  (https://ohwr.org/cern_ohl_s_v2.txt ).
  This source is distributed WITHOUT ANY EXPRESS OR IMPLIED
  WARRANTY, INCLUDING OF MERCHANTABILITY, SATISFACTORY
  QUALITY AND FITNESS FOR A PARTICULAR PURPOSE. Please see
  the CERN-OHL-S v2 for applicable conditions.
  Source location: https://github.com/paulhampson/smart-coaster-hw
  As per CERN-OHL-S v2 section 4, should You produce hardware based
  on this source, You must where practicable maintain the Source Location
  visible on the external case of the Smart Coaster or other products you make using
  this source.
sheet 2
- C22 to be close to pin 44
- C23 to be close to pin 45
- UART0
- I2C1
- GPIO8-11 Reserved for SPI1
- GPIO
- PIO0
- I2C0
- CLOCK GPIN1
- GPIO
- Copyright 2025 Paul Hampson
  This source describes Open Hardware and is licensed under the CERN-
  OHL-S v2.
  You may redistribute and modify this source and make products using it
  under the terms of the CERN-OHL-S v2
  (https://ohwr.org/cern_ohl_s_v2.txt ).
  This source is distributed WITHOUT ANY EXPRESS OR IMPLIED
  WARRANTY, INCLUDING OF MERCHANTABILITY, SATISFACTORY
  QUALITY AND FITNESS FOR A PARTICULAR PURPOSE. Please see
  the CERN-OHL-S v2 for applicable conditions.
  Source location: https://github.com/paulhampson/smart-coaster-hw
  As per CERN-OHL-S v2 section 4, should You produce hardware based
  on this source, You must where practicable maintain the Source Location
  visible on the external case of the Smart Coaster or other products you make using
  this source.
- USB BOOT
sheet 3
- Voltage Monitoring
- 3.3V Power Supply
- VBAT <5V
- Power In
- USB / Battery Switching
- Power Indicators
- 5V Power Supply
- Copyright 2025 Paul Hampson
  This source describes Open Hardware and is licensed under the CERN-
  OHL-S v2.
  You may redistribute and modify this source and make products using it
  under the terms of the CERN-OHL-S v2
  (https://ohwr.org/cern_ohl_s_v2.txt ).
  This source is distributed WITHOUT ANY EXPRESS OR IMPLIED
  WARRANTY, INCLUDING OF MERCHANTABILITY, SATISFACTORY
  QUALITY AND FITNESS FOR A PARTICULAR PURPOSE. Please see
  the CERN-OHL-S v2 for applicable conditions.
  Source location: https://github.com/paulhampson/smart-coaster-hw
  As per CERN-OHL-S v2 section 4, should You produce hardware based
  on this source, You must where practicable maintain the Source Location
  visible on the external case of the Smart Coaster or other products you make using
  this source.
sheet 4
- Close to U7
- RATE
  1 = 80SPS
  0 = 10SPS
- B / E-
- R / E+
- W / A-
- G / A+
- Load Cell ADC - 2mA
- Copyright 2025 Paul Hampson
  This source describes Open Hardware and is licensed under the CERN-
  OHL-S v2.
  You may redistribute and modify this source and make products using it
  under the terms of the CERN-OHL-S v2
  (https://ohwr.org/cern_ohl_s_v2.txt ).
  This source is distributed WITHOUT ANY EXPRESS OR IMPLIED
  WARRANTY, INCLUDING OF MERCHANTABILITY, SATISFACTORY
  QUALITY AND FITNESS FOR A PARTICULAR PURPOSE. Please see
  the CERN-OHL-S v2 for applicable conditions.
  Source location: https://github.com/paulhampson/smart-coaster-hw
  As per CERN-OHL-S v2 section 4, should You produce hardware based
  on this source, You must where practicable maintain the Source Location
  visible on the external case of the Smart Coaster or other products you make using
  this source.
sheet 5
- Real Time Clock - 0.2mA
- Copyright 2025 Paul Hampson
  This source describes Open Hardware and is licensed under the CERN-
  OHL-S v2.
  You may redistribute and modify this source and make products using it
  under the terms of the CERN-OHL-S v2
  (https://ohwr.org/cern_ohl_s_v2.txt ).
  This source is distributed WITHOUT ANY EXPRESS OR IMPLIED
  WARRANTY, INCLUDING OF MERCHANTABILITY, SATISFACTORY
  QUALITY AND FITNESS FOR A PARTICULAR PURPOSE. Please see
  the CERN-OHL-S v2 for applicable conditions.
  Source location: https://github.com/paulhampson/smart-coaster-hw
  As per CERN-OHL-S v2 section 4, should You produce hardware based
  on this source, You must where practicable maintain the Source Location
  visible on the external case of the Smart Coaster or other products you make using
  this source.
